# EAGLE design Res_Cut (EAGLE 9.6.1)
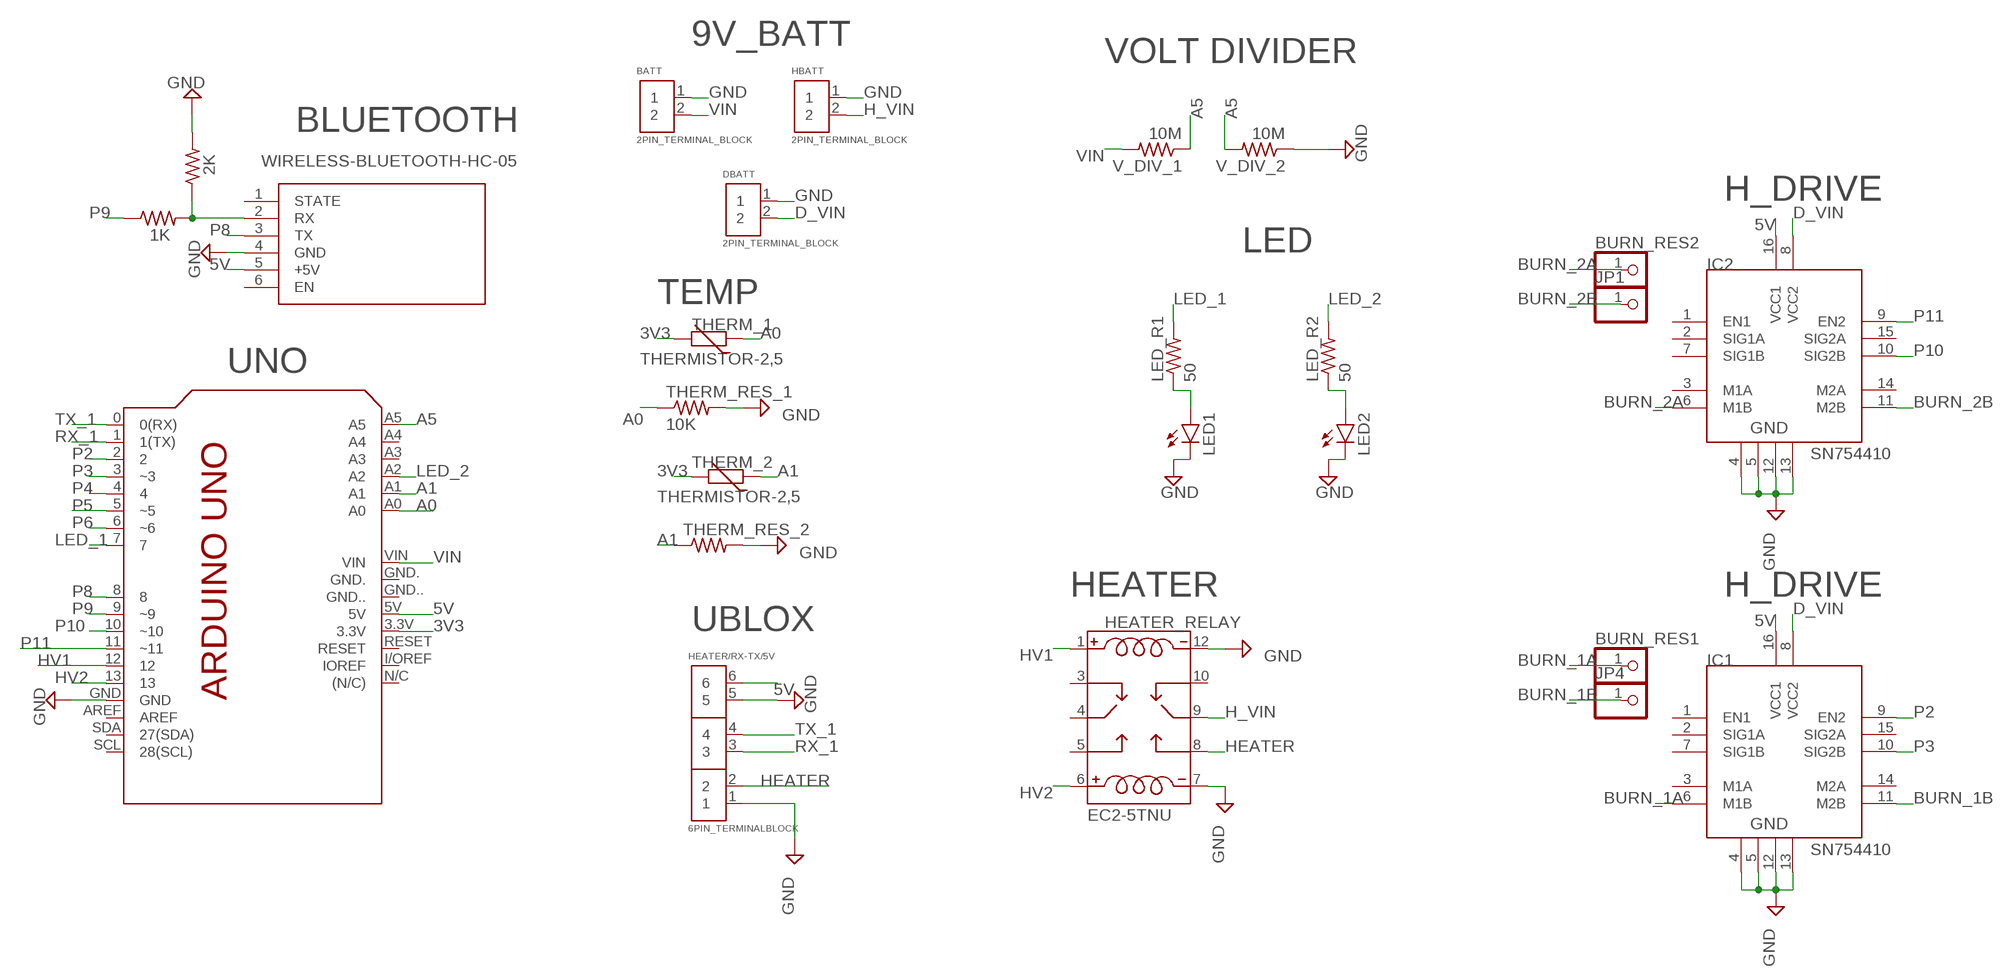
[diagram p0: schematic, sheet 1]

## Parts
BATT  2PIN_TERMINAL_BLOCK  [2PIN_TERMINAL_BLOCK]
BLUE_R1  1K  R-US_0204/7  [0204/7]
BLUE_R2  2K  R-US_0204/7  [0204/7]
BURN_RES1  PINHD-1X1CB  [1X01-CLEANBIG]
BURN_RES2  PINHD-1X1CB  [1X01-CLEANBIG]
DBATT  2PIN_TERMINAL_BLOCK  [2PIN_TERMINAL_BLOCK]
HBATT  2PIN_TERMINAL_BLOCK  [2PIN_TERMINAL_BLOCK]
HEATER/RX-TX/5V  6PIN_TERMINALBLOCK  [6PIN_TERMINALBLOCK]
HEATER_RELAY  EC2-5TNU  [RELAY_EC2-5TNU]
IC1  SN754410  [DIP16]
IC2  SN754410  [DIP16]
JP1  PINHD-1X1CB  [1X01-CLEANBIG]
JP4  PINHD-1X1CB  [1X01-CLEANBIG]
LED1  TLLR4400  [LED3MM]
LED2  TLLR4400  [LED3MM]
LED_R1  50  R-US_0204/7  [0204/7]
LED_R2  50  R-US_0204/7  [0204/7]
PCB1  ARDUINO_UNO  [ARDUINO_UNO]
THERM_1  THERMISTOR-2,5  [RS-2,5]
THERM_2  THERMISTOR-2,5  [RS-2,5]
THERM_RES_1  10K  R-US_0204/7  [0204/7]
THERM_RES_2  10K  R-US_0204/7  [0204/7]
U$1  WIRELESS-BLUETOOTH-HC-05  [WIRELESS-BLUETOOTH-HC-05]
V_DIV_1  10M  R-US_0204/7  [0204/7]
V_DIV_2  10M  R-US_0204/7  [0204/7]

## Nets
3V3: PCB1.3.3V THERM_1.2 THERM_2.2
5V: HEATER/RX-TX/5V.6 IC1.16(VCC1) IC2.16(VCC1) PCB1.5V U$1.5(+5V)
A0: PCB1.A0 THERM_1.1 THERM_RES_1.1
A1: PCB1.A1 THERM_2.1 THERM_RES_2.1
A5: PCB1.A5 V_DIV_1.1 V_DIV_2.2
BLUE_R2: LED2.A LED_R2.1
BURN_1A: BURN_RES1.1 IC1.6(M1B)
BURN_1B: IC1.11(M2B) JP4.1
BURN_2A: BURN_RES2.1 IC2.6(M1B)
BURN_2B: IC2.11(M2B) JP1.1
D_VIN: DBATT.2 IC1.8(VCC2) IC2.8(VCC2)
GND: BATT.1 BLUE_R2.2 DBATT.1 HBATT.1 HEATER/RX-TX/5V.1 HEATER/RX-TX/5V.5 HEATER_RELAY.7(C4) HEATER_RELAY.12(C2) IC1.4 IC1.5 IC1.12 IC1.13 IC2.4 IC2.5 IC2.12 IC2.13 LED1.K(C) LED2.K(C) PCB1.GND THERM_RES_1.2 THERM_RES_2.2 U$1.4(GND) V_DIV_2.1
H_VIN: HBATT.2 HEATER_RELAY.9(M)
HEATER: HEATER/RX-TX/5V.2 HEATER_RELAY.8(NO)
HV1 [5V_Relay]: HEATER_RELAY.1(C1) PCB1.12
HV2 [5V_Relay]: HEATER_RELAY.6(C3) PCB1.13
LED_1: LED_R1.2 PCB1.7
LED_2: LED_R2.2 PCB1.A2
N$3: BLUE_R1.2 BLUE_R2.1 U$1.2(RX)
N$4: LED1.A LED_R1.1
P2: IC1.9(EN2) PCB1.2
P3: IC1.10(SIG2B) PCB1.3(~3)
P4: PCB1.4
P5: PCB1.5(~5)
P6: PCB1.6(~6)
P8: PCB1.8 U$1.3(TX)
P9: BLUE_R1.1 PCB1.9(~9)
P10: IC2.10(SIG2B) PCB1.10(~10)
P11: IC2.9(EN2) PCB1.11(~11)
RX_1: HEATER/RX-TX/5V.3 PCB1.1(1(TX))
TX_1: HEATER/RX-TX/5V.4 PCB1.0(0(RX))
VIN: BATT.2 PCB1.VIN V_DIV_1.2
Unconnected: HEATER_RELAY.3(NC1) HEATER_RELAY.4(M1) HEATER_RELAY.5(NO1) HEATER_RELAY.10(NC) IC1.1(EN1) IC1.2(SIG1A) IC1.3(M1A) IC1.7(SIG1B) IC1.14(M2A) IC1.15(SIG2A) IC2.1(EN1) IC2.2(SIG1A) IC2.3(M1A) IC2.7(SIG1B) IC2.14(M2A) IC2.15(SIG2A) PCB1.A3 PCB1.A4 PCB1.AREF PCB1.GND. PCB1.GND.. PCB1.I/OREF(IOREF) PCB1.N/C((N/C)) PCB1.RESET PCB1.SCL(28(SCL)) PCB1.SDA(27(SDA)) U$1.1(STATE) U$1.6(EN)

## Notes on the sheet
- 9V_BATT
- VOLT DIVIDER
- BLUETOOTH
- H_DRIVE
- LED
- TEMP
- UNO
- HEATER | H_DRIVE
- UBLOX

## Library data of the parts
BATT DBATT HBATT = Terminal_Block:2PIN_TERMINAL_BLOCK: Terminal block; 2.54mm; angled 90°; 0.03÷1mm2; ways: 2; 10A; H: 10mm; CENTERLINE_PITCH: 2.54 mm[.1 in]; COMMENT: 282834-2; DESCRIPTION: TERMI-BLOK PCB MOUNT, 90 2P.; DIGI-KEY_PART_NUMBER: A98333-ND; DIGI-KEY_PURCHASE_URL: https://www.digikey.com/product-detail/en/te-connectivity-amp-connectors/282834-2/A98333-ND/1150135?utm_source=snapeda&utm_medium=aggregator&utm_campaign=symbol; EU_ROHS_COMPLIANCE: Compliant with Exemptions; MF: TE Connectivity; MP: 282834-2; NUMBER_OF_POSITIONS: 2; PACKAGE: None; TE_PURCHASE_URL: https://www.te.com/usa-en/product-282834-2.html?te_bu=Cor&te_type=disp&te_campaign=seda_glo_cor-seda-global-disp-prtnr-fy19-seda-model-bom-cta_sma-317_1&elqCampaignId=32493
BLUE_R1 BLUE_R2 THERM_RES_1 THERM_RES_2 = rcl:R-US_: RESISTOR, American symbol; SPICEPREFIX: R
BURN_RES1 BURN_RES2 JP1 JP4 = adafruit:PINHD-1X1: Pin header 1x1 for 0.1" spacing With round pins
HEATER/RX-TX/5V = 6_Pin_Terminal_Block:6PIN_TERMINALBLOCK
HEATER_RELAY = EC2-5TNU:EC2-5TNU: Relay; E-Mech; Latching; DPDT; Ctrl-V 5DC; 2A; 250VAC; PCB Mnt; Thru Hole; EC2/EE2 Series; AVAILABILITY: Unavailable; DESCRIPTION: Relay; E-Mech; Latching; DPDT; Ctrl-V 5DC; 2A; 250VAC; PCB Mnt; Thru Hole; EC2/EE2 Series; MF: KEMET; MP: EC2-5TNU; PACKAGE: None; PRICE: None
IC1 IC2 = HBridge:SN754410: Quadruple half-H driver
LED1 LED2 = led:TLLR4400: Low Current (2mA) LED 3 mm Tinted Diffused Package color RED Source: Data sheet <http://www.farnell.com/datasheets/391100.pdf>; MF: VISHAY SEMICONDUCTOR; OC_FARNELL: 1612437
LED_R1 LED_R2 V_DIV_1 V_DIV_2 = resistor:R-US_: RESISTOR, American symbol
PCB1 = E14_Arduino_revC:ARDUINO_UNO: Device for representing an Arduino Uno board with a footprint in an EAGLE design. Created by Dave Young for Element14. More EAGLE documentation at: http://www.element14.com/community/community/knode/cadsoft_eagle
THERM_1 THERM_2 = varistor:THERMISTOR: THERMISTOR
U$1 = diy-modules:WIRELESS-BLUETOOTH-HC-05: Bluetooth Transceiver Module based on HC-05 board Tutorial is available here: https://arduino-info.wikispaces.com/BlueTooth-HC05-HC06-Modules-How-To Click here to find device on ebay.com <http://www.ebay.com/sch/hc-05+module+rs232>

## Net classes
1 5V_Relay: width 0.305 mm, drill 0.35 mm, clearance 0.127 mm

## Board
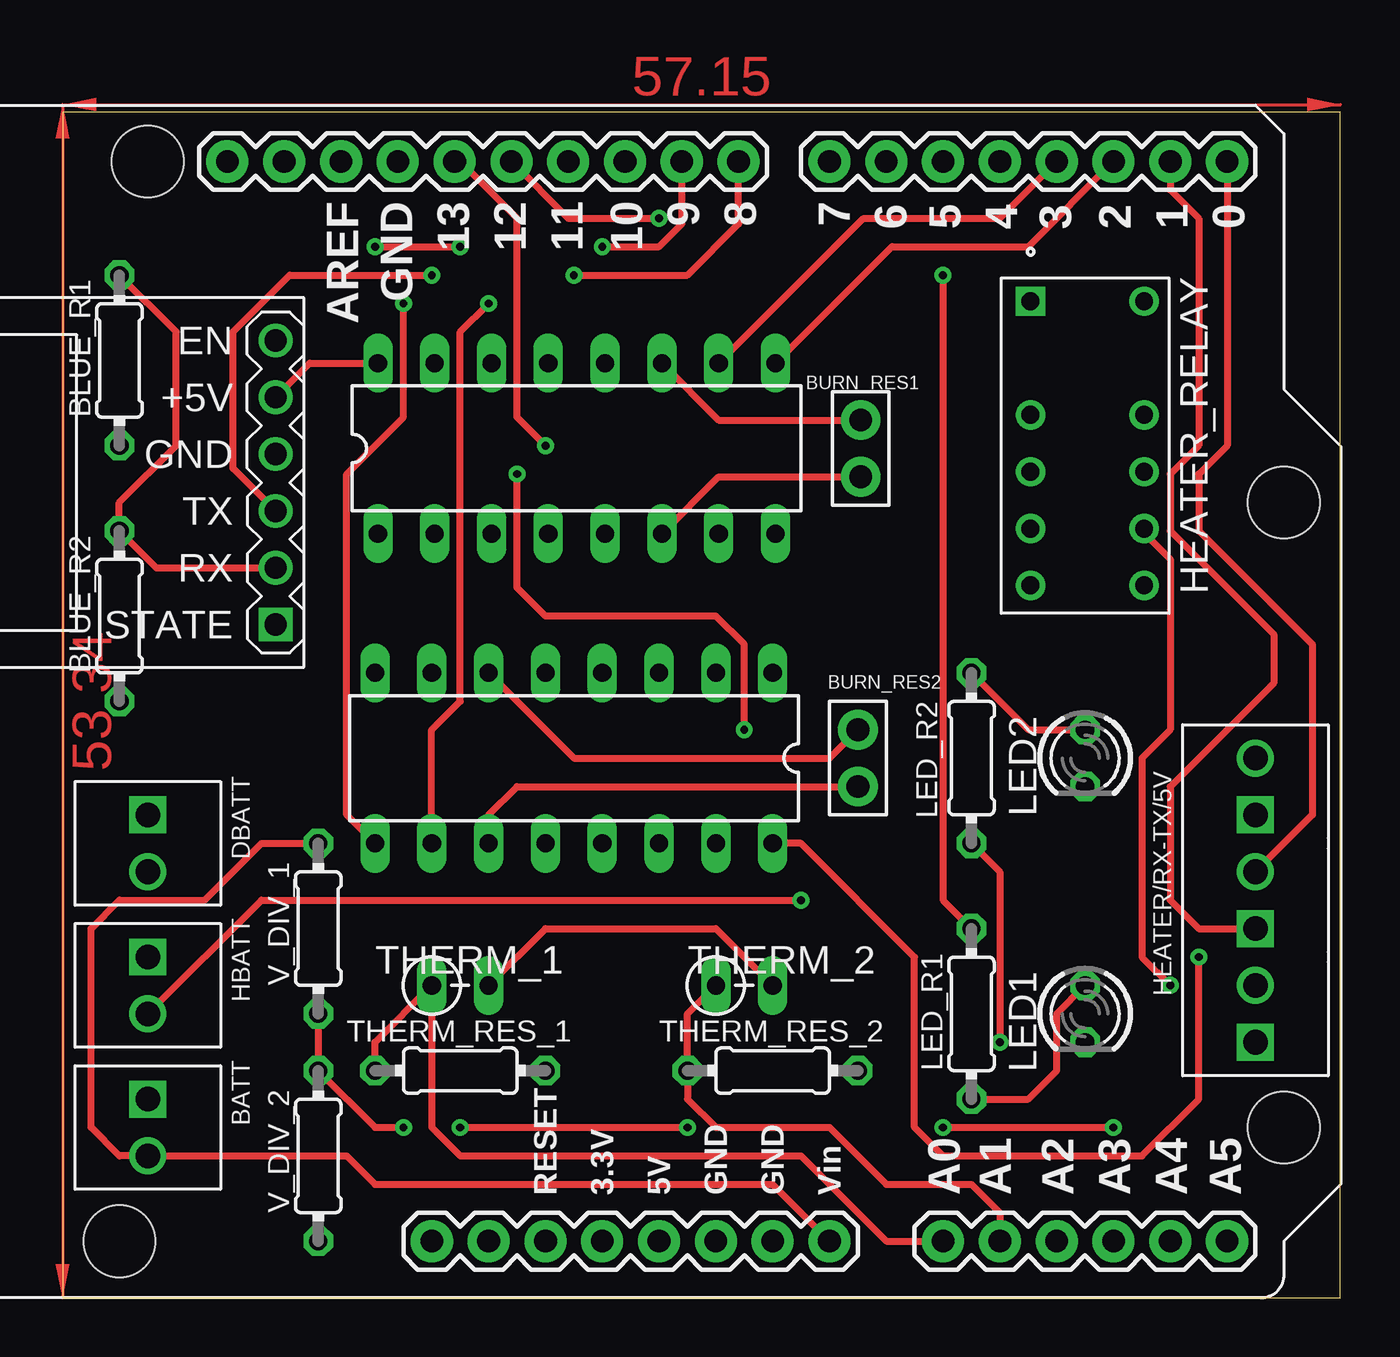
[diagram p1: board, top side]
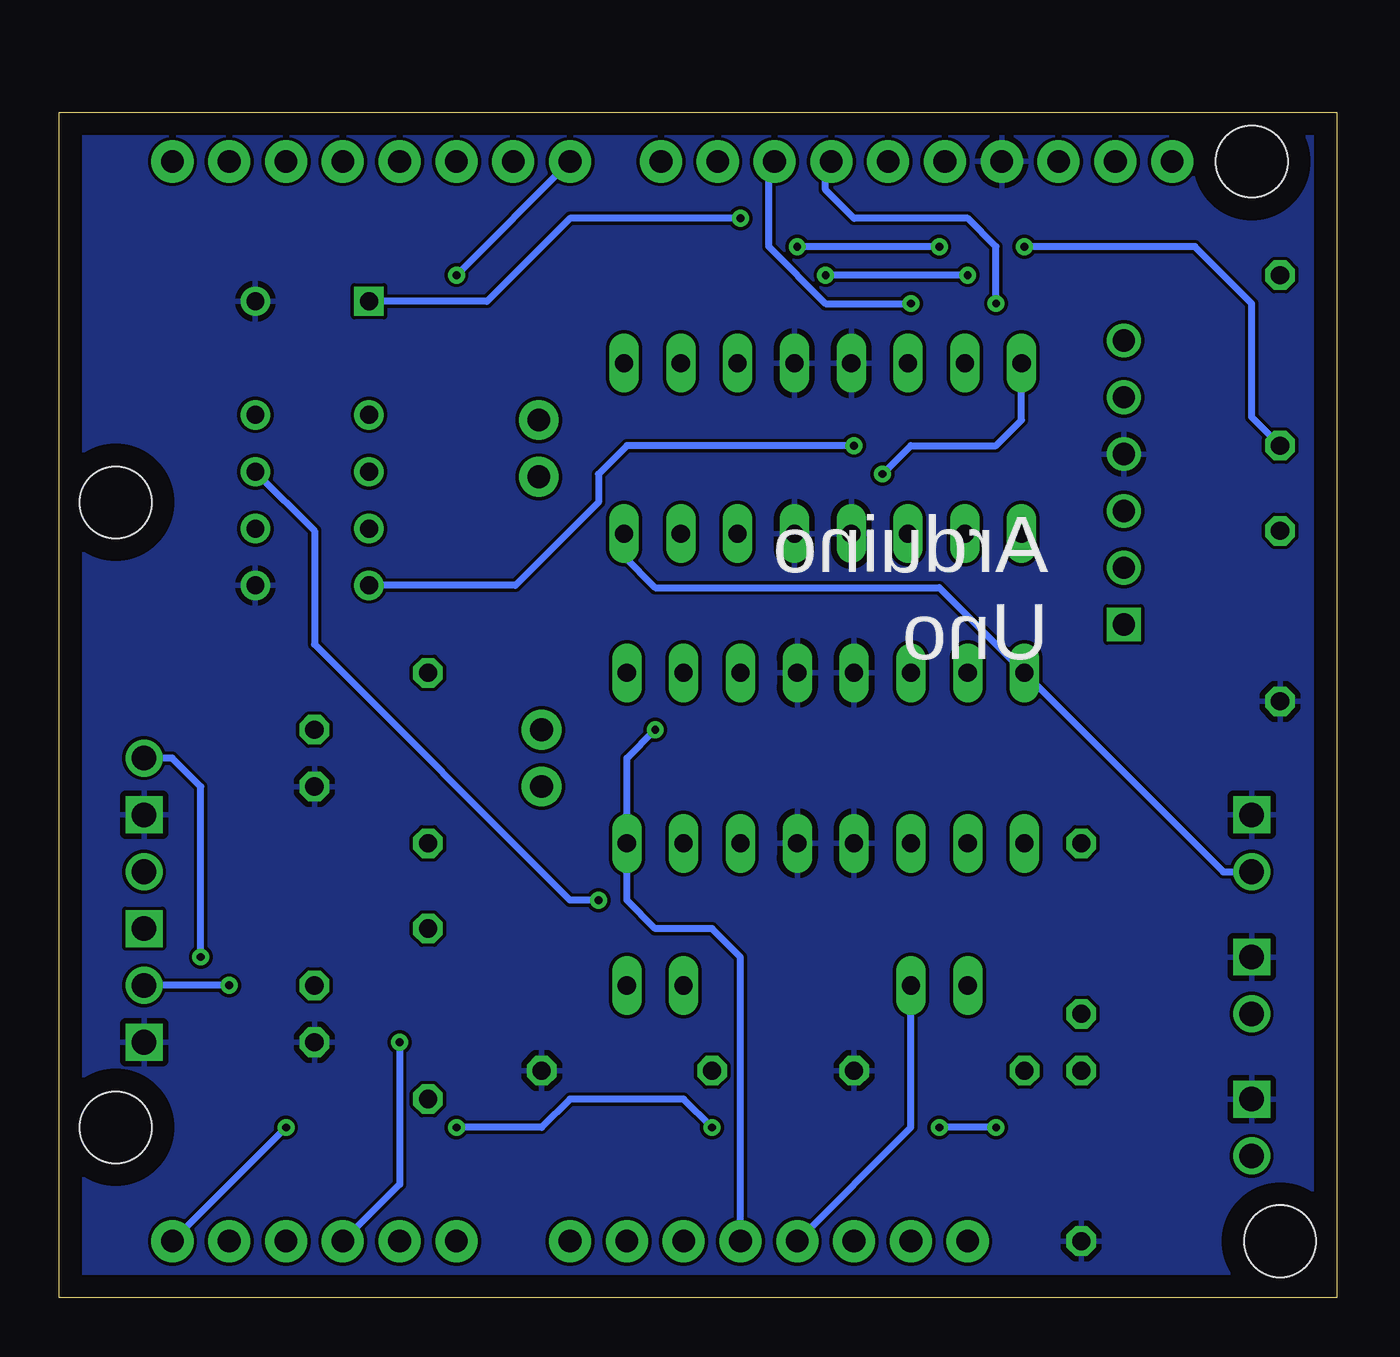
[diagram p2: board, bottom side, seen from below]

Size 57.13 x 53.01 mm. Coordinates in mm from the lower left corner, seen from the top.
Outline: 0,0 57.13,0 57.13,53.01 0,53.01 0,0
Copper layers (1*16): Top 0.035mm / dielectric 1.5mm / Bottom 0.035mm
Design rules "default": minimum track width 6mil, minimum drill 0.35mm, track to track 6mil, track to pad 6mil, pad to pad 6mil, via to via 6mil, smd to smd 6mil, copper to edge 40mil, drill to drill 6mil, minimum pad ring 10mil, minimum via ring 8mil, stop-mask expansion 4mil, vias tented up to drill 0mil, thermal gap 10mil

### Footprints (pad centres in the part's own frame; a part is rotated, then mirrored left to right if it is on the bottom)
2PIN_TERMINAL_BLOCK = drill 1.1 square: 1 -1.27,0 | drill 1.1: 2 1.27,0
0204/7 = drill 0.813 octagon: 1 -3.81,0; 2 3.81,0
1X01-CLEANBIG = drill 1.016 pad 1.778: 1 0,0
6PIN_TERMINALBLOCK = drill 1.1 square: 1 -6.35,0; 3 -1.27,0; 5 3.81,0 | drill 1.1: 2 -3.81,0; 4 1.27,0; 6 6.35,0
RELAY_EC2-5TNU = drill 0.8 square: 1 -6.45,-2.44 | drill 0.8: 3 -1.37,-2.44; 4 1.17,-2.44; 5 3.71,-2.44; 6 6.25,-2.44; 7 6.25,2.64; 8 3.71,2.64; 9 1.17,2.64; 10 -1.37,2.64; 12 -6.45,2.64
DIP16 = drill 0.813 long: 1 -10.16,-3.81; 2 -7.62,-3.81; 3 -5.08,-3.81; 4 -2.54,-3.81; 5 0,-3.81; 6 2.54,-3.81; 7 5.08,-3.81; 8 7.62,-3.81; 9 7.62,3.81; 10 5.08,3.81; 11 2.54,3.81; 12 0,3.81; 13 -2.54,3.81; 14 -5.08,3.81; 15 -7.62,3.81; 16 -10.16,3.81
LED3MM = drill 0.813 octagon: A -1.27,0; K 1.27,0
ARDUINO_UNO = drill 1.016 pad 1.88: 0 63.5,50.8; 1 60.96,50.8; 2 58.42,50.8; 3 55.88,50.8; 3.3V 35.56,2.54; 4 53.34,50.8; 5 50.8,50.8; 5V 38.1,2.54; 6 48.26,50.8; 7 45.72,50.8; 8 41.656,50.8; 9 39.116,50.8; 10 36.576,50.8; 11 34.036,50.8; 12 31.496,50.8; 13 28.956,50.8; A0 50.8,2.54; A1 53.34,2.54; A2 55.88,2.54; A3 58.42,2.54; A4 60.96,2.54; A5 63.5,2.54; AREF 23.876,50.8; GND 26.416,50.8; GND. 43.18,2.54; GND.. 40.64,2.54; I/OREF 30.48,2.54; N/C 27.94,2.54; RESET 33.02,2.54; SCL 18.796,50.8; SDA 21.336,50.8; VIN 45.72,2.54 | hole 3.2: 66.04,7.62; 66.04,35.56; 15.24,50.8; 13.97,2.54
RS-2,5 = drill 0.813 long: 1 -1.27,0; 2 1.27,0
WIRELESS-BLUETOOTH-HC-05 = drill 1 square: 1 -6.35,-17.145 | drill 1: 2 -3.81,-17.145; 3 -1.27,-17.145; 4 1.27,-17.145; 5 3.81,-17.145; 6 6.35,-17.145

### Placement (x,y rotation side)
BATT  3.81,7.62 270 top
BLUE_R1  2.54,41.91 90 top
BLUE_R2  2.54,30.48 270 top
BURN_RES1  35.69,36.7 180 top
BURN_RES2  35.56,25.4 0 top
DBATT  3.81,20.32 270 top
HBATT  3.81,13.97 270 top
HEATER/RX-TX/5V  53.34,17.78 90 top
HEATER_RELAY  45.72,38.1 270 top
IC1  24.26,37.97 0 top
IC2  21.59,24.13 180 top
JP1  35.56,22.86 0 top
JP4  35.69,39.24 180 top
LED1  45.72,12.7 270 top
LED2  45.72,24.13 270 top
LED_R1  40.64,12.7 90 top
LED_R2  40.64,24.13 270 top
PCB1  -11.43,0 0 top
THERM_1  17.78,13.97 0 top
THERM_2  30.48,13.97 0 top
THERM_RES_1  17.78,10.16 0 top
THERM_RES_2  31.75,10.16 0 top
U$1  -7.62,36.45 90 top
V_DIV_1  11.43,16.51 90 top
V_DIV_2  11.43,6.35 90 top

### Tracks (layer width: path | path; a pad name or v marks a point on that pad's centre or on a via)
3V3
  Top 0.305: THERM_1.2 21.59,16.51 29.21,16.51 THERM_2.2
  Bottom 0.305: PCB1.3.3V 19.05,7.62 THERM_1.2
5V  (via drill 0.35)
  Top 0.305: IC2.16 33.02,20.32 38.1,15.24 38.1,7.62 39.37,6.35 48.26,6.35 50.8,8.89 v50.8,15.24 | U$1.5 11.05,41.78 IC1.16 | v30.48,25.4 30.48,29.21 29.21,30.48 21.59,30.48 20.32,31.75 v20.32,36.83
  Bottom 0.305: PCB1.5V 26.67,15.24 27.94,16.51 30.48,16.51 31.75,17.78 IC2.16 31.75,24.13 v30.48,25.4 | 14.1,40.51 IC1.16 14.1,39.24 15.24,38.1 19.05,38.1 v20.32,36.83 | HEATER/RX-TX/5V.6 52.07,24.13 50.8,22.86 v50.8,15.24
A0
  Top 0.305: THERM_RES_1.1 13.97,11.43 THERM_1.1 16.51,7.62 17.78,6.35 33.02,6.35 36.83,2.54 PCB1.A0
A1
  Top 0.305: THERM_2.1 27.94,12.7 THERM_RES_2.1 27.94,8.89 29.21,7.62 34.29,7.62 36.83,5.08 40.64,5.08 41.91,3.81 PCB1.A1
A5  (via drill 0.35)
  Top 0.305: V_DIV_1.1 V_DIV_2.2 13.97,7.62 v15.24,7.62 | v17.78,7.62 v27.94,7.62 | v39.37,7.62 v46.99,7.62
  Bottom 0.305: v15.24,7.62 v17.78,7.62 | v27.94,7.62 29.21,8.89 34.29,8.89 35.56,7.62 v39.37,7.62 | v46.99,7.62 PCB1.A5
BLUE_R2
  Top 0.305: LED_R2.1 43.18,25.4 LED2.A
BURN_1A
  Top 0.305: IC1.6 29.34,36.7 BURN_RES1.1
BURN_1B
  Top 0.305: IC1.11 29.34,39.24 JP4.1
BURN_2A
  Top 0.305: IC2.6 22.86,24.13 34.29,24.13 BURN_RES2.1
BURN_2B
  Top 0.305: IC2.11 19.05,21.59 20.32,22.86 JP1.1
D_VIN
  Bottom 0.305: IC1.8 31.88,33.15 30.48,31.75 17.78,31.75 IC2.8 5.08,19.05 DBATT.2
GND
  pour Bottom: 0,53.34 0,0 57.15,0 57.15,53.34
H_VIN  (via drill 0.35)
  Top 0.305: HBATT.2 8.89,17.78 v33.02,17.78
  Bottom 0.305: v33.02,17.78 34.29,17.78 45.72,29.21 45.72,34.29 HEATER_RELAY.9
HEATER  (via drill 0.35)
  Top 0.305: HEATER_RELAY.8 48.36,34.19 49.53,33.02 49.53,25.4 48.26,24.13 48.26,15.24 v49.53,13.97
  Bottom 0.305: v49.53,13.97 HEATER/RX-TX/5V.2
HV1  (via drill 0.35)
  Top 0.305: PCB1.12 22.61,48.26 v26.67,48.26
  Bottom 0.305: v26.67,48.26 34.29,48.26 38,44.55 HEATER_RELAY.1
HV2  (via drill 0.35)
  Top 0.305: v21.59,38.1 20.32,39.37 20.32,48.26 17.78,50.8 PCB1.13
  Bottom 0.305: v21.59,38.1 31.75,38.1 33.02,36.83 33.02,35.56 36.73,31.85 HEATER_RELAY.6
LED_1  (via drill 0.35)
  Top 0.305: v39.37,45.72 39.37,17.78 LED_R1.2
  Bottom 0.305: PCB1.7 v39.37,45.72
LED_2  (via drill 0.35)
  Top 0.305: LED_R2.2 41.91,19.05 v41.91,11.43
  Bottom 0.305: PCB1.A2 41.91,5.08 v41.91,11.43
N$3
  Top 0.305: BLUE_R1.2 5.08,43.18 5.08,38.1 2.54,35.56 BLUE_R2.1 4.19,32.64 U$1.2
N$4
  Top 0.305: LED_R1.1 43.18,8.89 44.45,10.16 44.45,12.7 LED1.A
P2
  Top 0.305: IC1.9 37.08,46.99 43.18,46.99 PCB1.2
P3
  Top 0.305: IC1.10 35.81,48.26 41.91,48.26 PCB1.3
P8  (via drill 0.35)
  Top 0.305: U$1.3 7.62,37.08 7.62,43.18 10.16,45.72 v16.51,45.72 | PCB1.8 30.23,48.01 27.94,45.72 v22.86,45.72
  Bottom 0.305: v16.51,45.72 v22.86,45.72
P9  (via drill 0.35)
  Top 0.305: v13.97,46.99 v17.78,46.99 | v24.13,46.99 26.67,46.99 27.69,48.01 PCB1.9
  Bottom 0.305: BLUE_R1.1 3.81,39.37 3.81,44.45 6.35,46.99 v13.97,46.99 | v17.78,46.99 v24.13,46.99
P10  (via drill 0.35)
  Top 0.305: IC2.10 16.51,25.4 17.78,26.67 17.78,43.18 v19.05,44.45
  Bottom 0.305: PCB1.10 25.4,50.55 25.4,46.99 22.86,44.45 v19.05,44.45
P11  (via drill 0.35)
  Top 0.305: IC2.9 12.7,21.59 12.7,36.83 15.24,39.37 v15.24,44.45
  Bottom 0.305: v15.24,44.45 15.24,46.99 16.51,48.26 21.59,48.26 22.86,49.53 22.86,50.55 PCB1.11
RX_1
  Top 0.305: PCB1.1 49.53,49.53 50.8,48.26 50.8,38.1 49.53,36.83 49.53,34.29 54.15,29.67 54.15,27.48 49.53,22.86 49.53,17.78 50.8,16.51 HEATER/RX-TX/5V.3
TX_1
  Top 0.305: PCB1.0 52.07,38.1 50.8,36.83 50.8,34.29 55.88,29.21 55.88,21.59 HEATER/RX-TX/5V.4
VIN
  Top 0.305: PCB1.VIN 31.75,5.08 13.97,5.08 12.7,6.35 BATT.2 2.54,6.35 1.27,7.62 1.27,16.51 2.54,17.78 6.35,17.78 8.89,20.32 V_DIV_1.2
(copper drawn outside any net)
  shapes: Top area x2